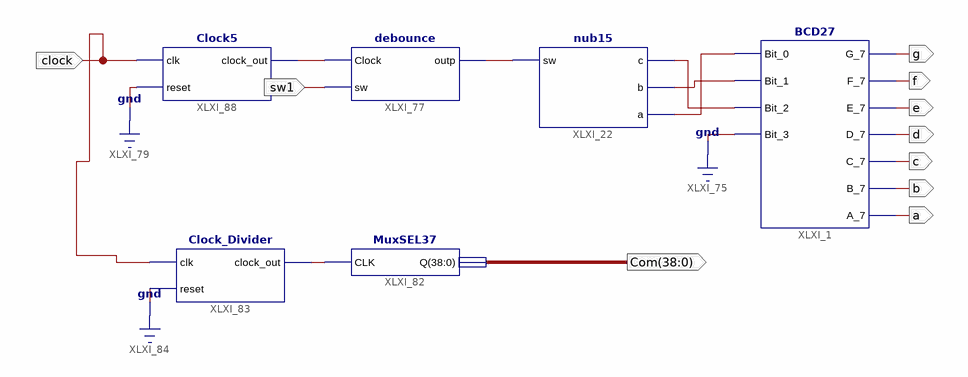
[diagram p0: schematic sheet 1]
// Xilinx ISE schematic test7.sch (spartan6) as structural Verilog: 6 symbols, 10 ports
module test7 (
  input  sw1,
  input  clock,
  output g,
  output f,
  output e,
  output d,
  output c,
  output b,
  output a,
  output [38:0] Com
);

  wire sw, XLXN_90, XLXN_91, XLXN_92, XLXN_94, XLXN_98;

  BCD27 XLXI_1 (
    .A_7(a), .Bit_0(XLXN_90), .Bit_1(XLXN_91), .Bit_2(XLXN_92), .Bit_3(1'b0), .B_7(b), .C_7(c), .D_7(d),
    .E_7(e), .F_7(f), .G_7(g));
  nub15 XLXI_22 (.a(XLXN_90), .b(XLXN_91), .c(XLXN_92), .sw(sw));
  debounce XLXI_77 (.Clock(XLXN_94), .sw(sw1), .outp(sw));
  MuxSEL37 XLXI_82 (.CLK(XLXN_98), .Q(Com));
  Clock_Divider XLXI_83 (.clk(clock), .reset(1'b0), .clock_out(XLXN_98));
  Clock5 XLXI_88 (.clk(clock), .reset(1'b0), .clock_out(XLXN_94));
endmodule
